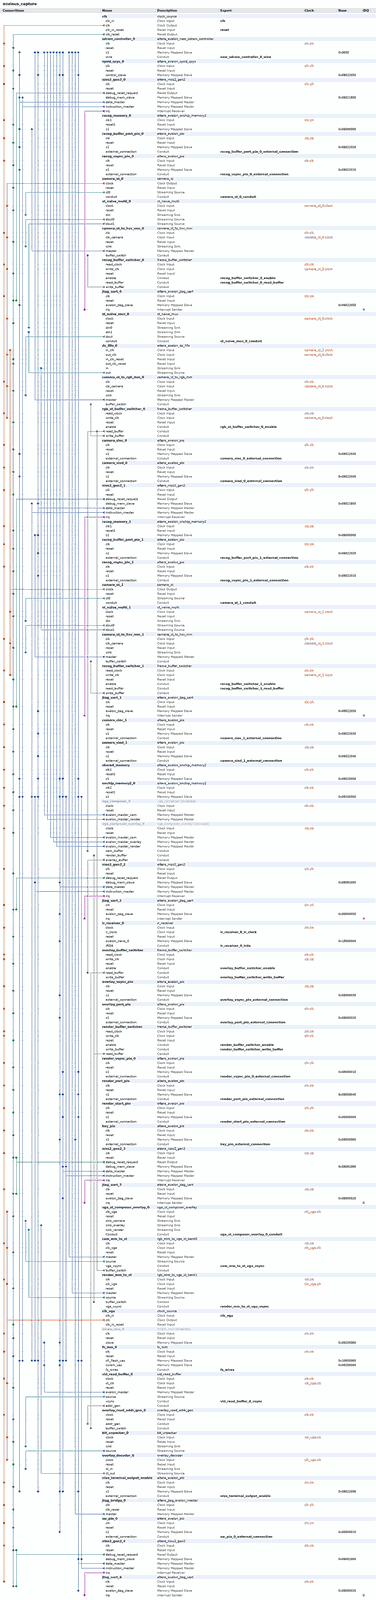
[diagram p0: system contents, whole]
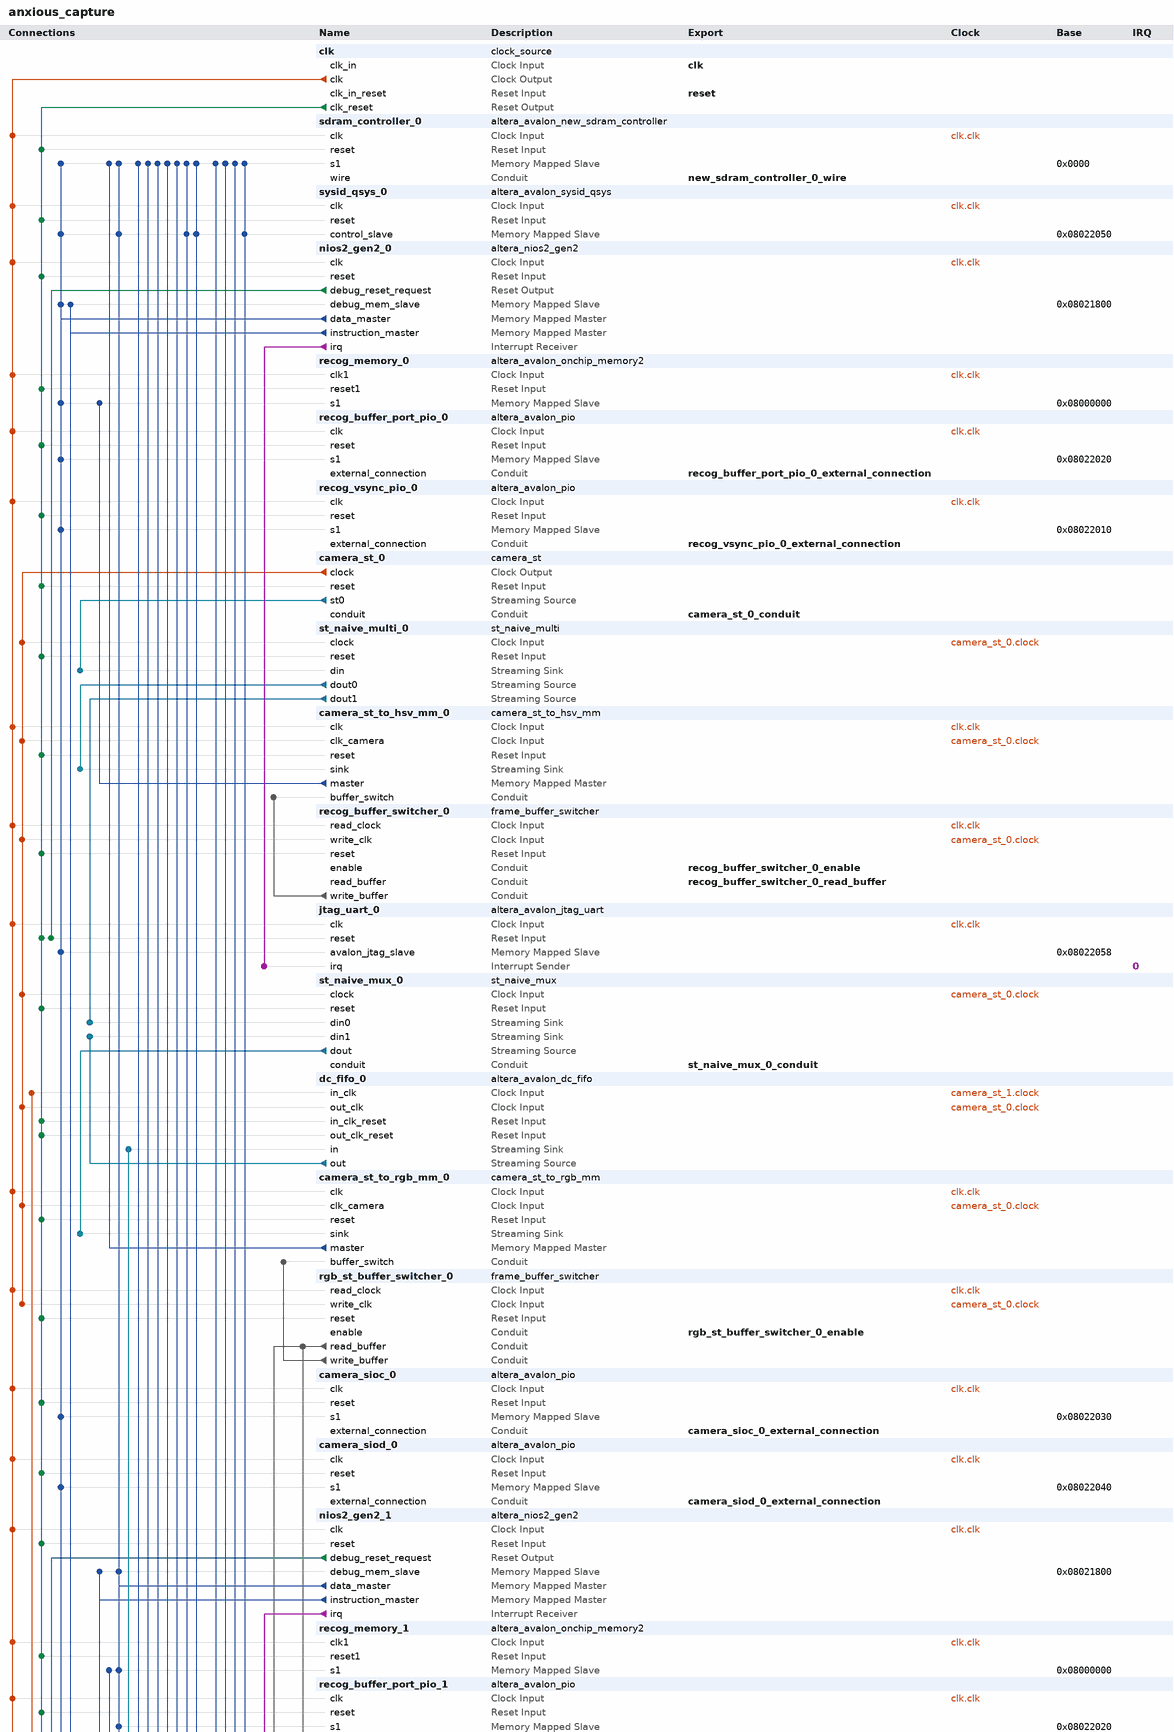
[diagram p1: system contents, upper part]
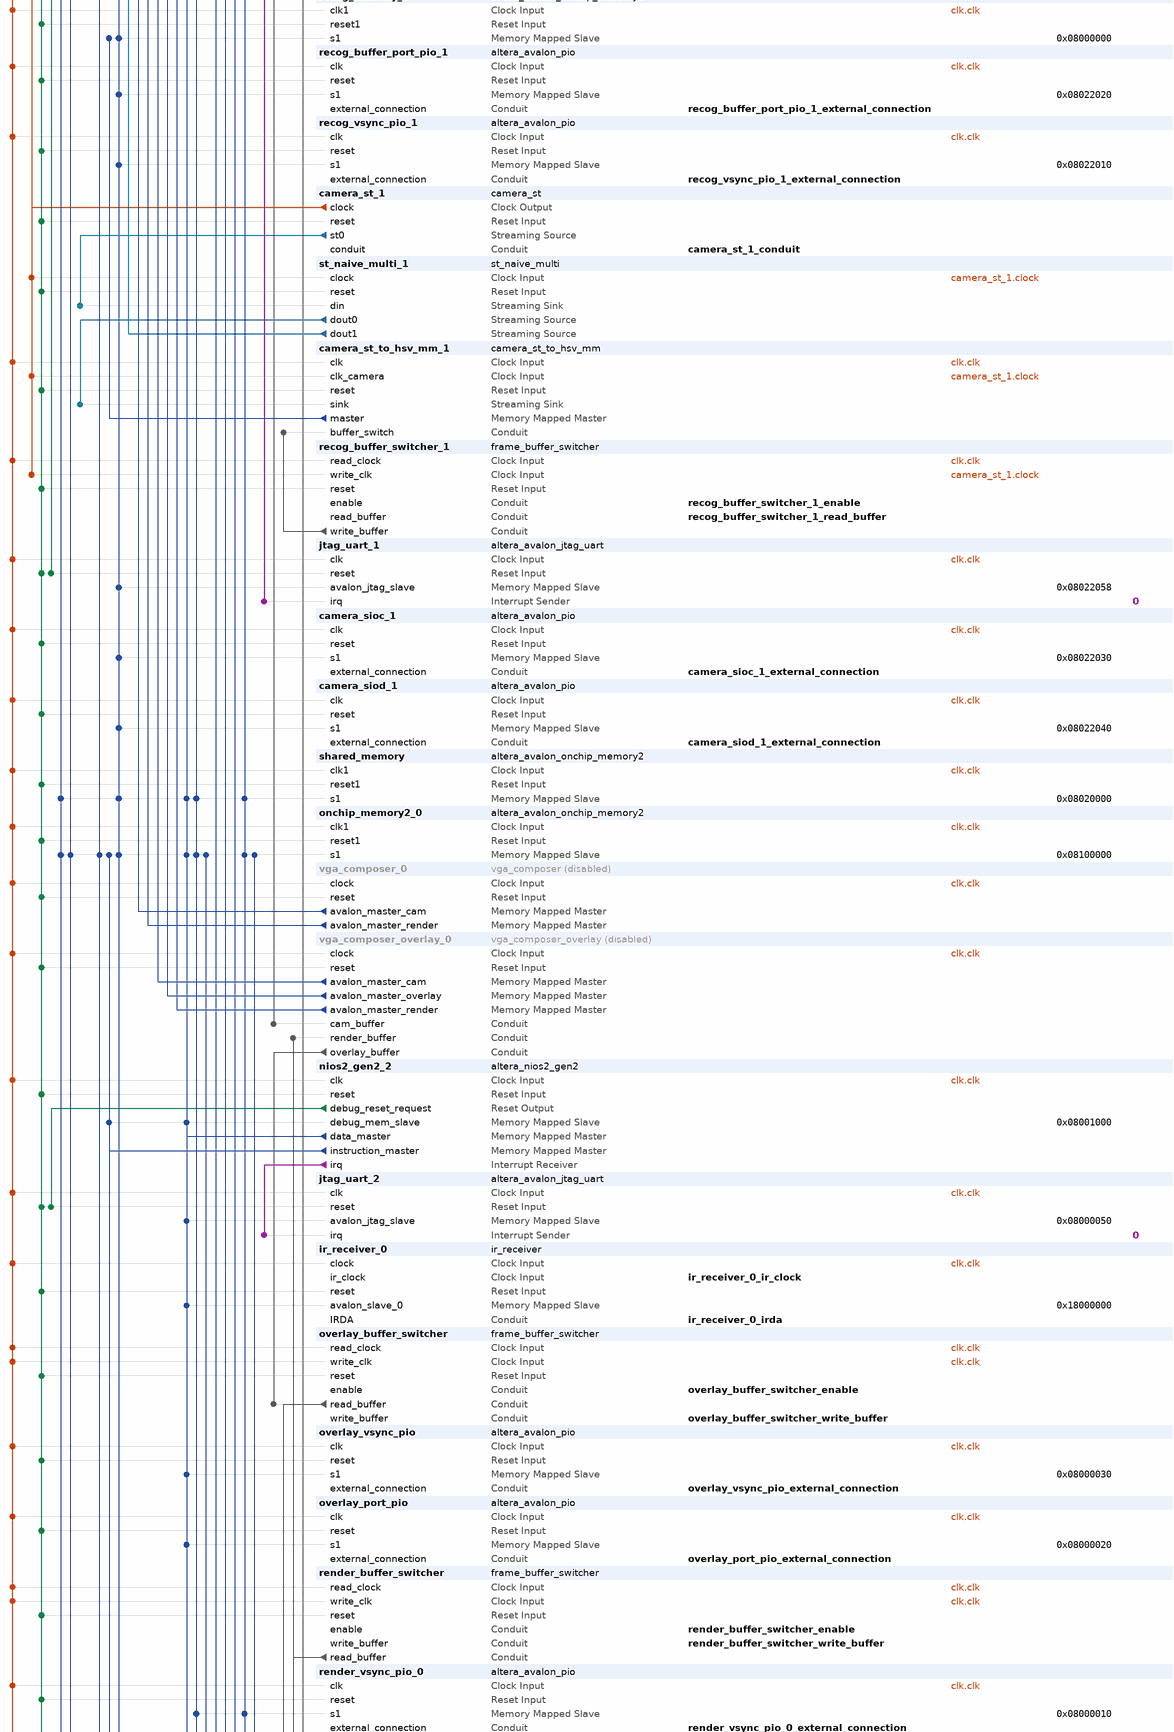
[diagram p2: system contents, middle part]
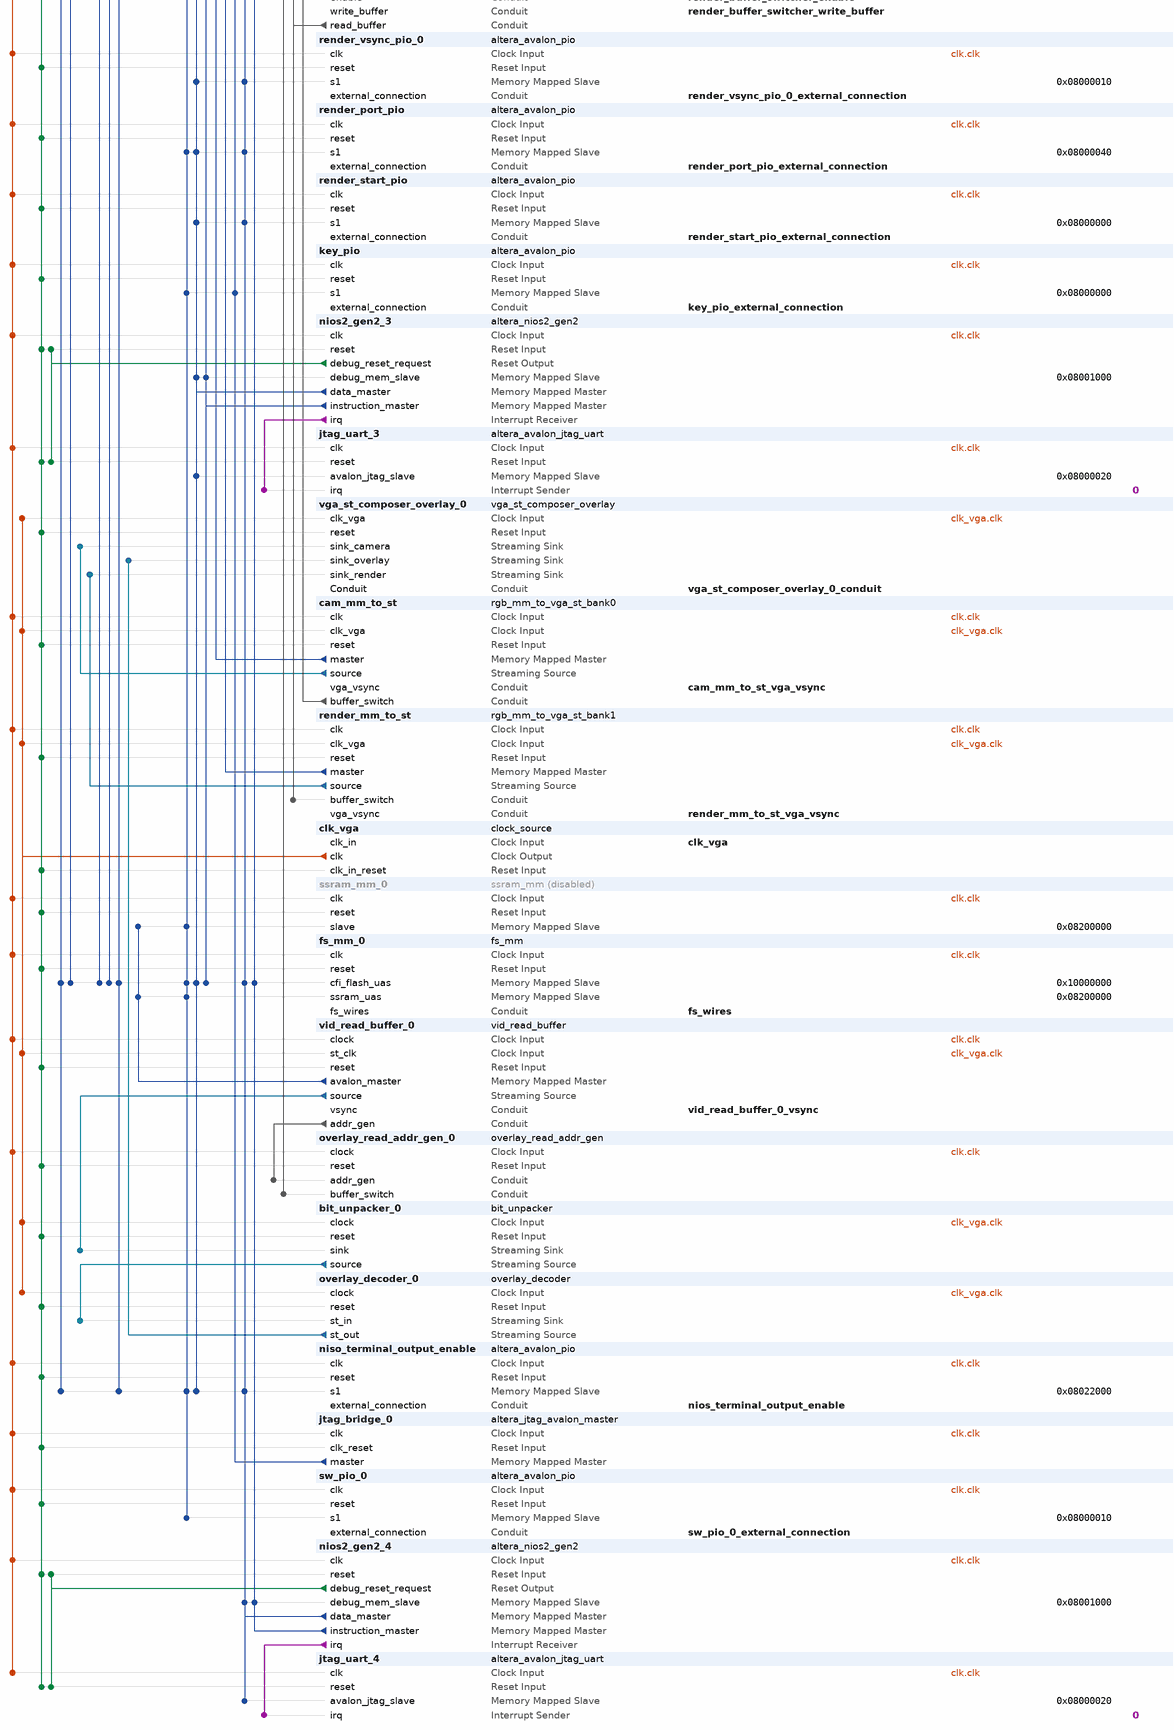
[diagram p3: system contents, lower part]
# Platform Designer (Qsys) system anxious_capture, Cyclone IV GX EP4CGX150DF31C7
# Parameters at their usual value, and those the tool derives, are not listed.
package require -exact qsys 15.0
create_system anxious_capture
set_project_property DEVICE_FAMILY {Cyclone IV GX}
set_project_property DEVICE EP4CGX150DF31C7

add_instance clk clock_source 15.0
set_instance_parameter_value clk clockFrequency 100000000

add_instance sdram_controller_0 altera_avalon_new_sdram_controller 15.0
set_instance_parameter_value sdram_controller_0 TAC 5.5
set_instance_parameter_value sdram_controller_0 TRCD 20.0
set_instance_parameter_value sdram_controller_0 TRP 20.0
set_instance_parameter_value sdram_controller_0 casLatency 3
set_instance_parameter_value sdram_controller_0 columnWidth 10
set_instance_parameter_value sdram_controller_0 dataWidth 32
set_instance_parameter_value sdram_controller_0 generateSimulationModel true
set_instance_parameter_value sdram_controller_0 initRefreshCommands 8
set_instance_parameter_value sdram_controller_0 model single_Micron_MT48LC4M32B2_7_chip
set_instance_parameter_value sdram_controller_0 numberOfBanks 4
set_instance_parameter_value sdram_controller_0 numberOfChipSelects 1
set_instance_parameter_value sdram_controller_0 powerUpDelay 100.0
set_instance_parameter_value sdram_controller_0 refreshPeriod 7.8125
set_instance_parameter_value sdram_controller_0 rowWidth 13

add_instance sysid_qsys_0 altera_avalon_sysid_qsys 15.0
set_instance_parameter_value sysid_qsys_0 id 286331153

add_instance nios2_gen2_0 altera_nios2_gen2 15.0
set_instance_parameter_value nios2_gen2_0 dcache_size 4096
set_instance_parameter_value nios2_gen2_0 dividerType srt2
set_instance_parameter_value nios2_gen2_0 exceptionSlave onchip_memory2_0.s1
set_instance_parameter_value nios2_gen2_0 icache_size 4096
set_instance_parameter_value nios2_gen2_0 impl Fast
set_instance_parameter_value nios2_gen2_0 resetSlave fs_mm_0_cfi_flash.uas

add_instance recog_memory_0 altera_avalon_onchip_memory2 15.0
set_instance_parameter_value recog_memory_0 dataWidth 32
set_instance_parameter_value recog_memory_0 dualPort false
set_instance_parameter_value recog_memory_0 initMemContent true
set_instance_parameter_value recog_memory_0 initializationFileName onchip_mem.hex
set_instance_parameter_value recog_memory_0 memorySize 81920

add_instance recog_buffer_port_pio_0 altera_avalon_pio 15.0
set_instance_parameter_value recog_buffer_port_pio_0 direction Input
set_instance_parameter_value recog_buffer_port_pio_0 width 2

add_instance recog_vsync_pio_0 altera_avalon_pio 15.0
set_instance_parameter_value recog_vsync_pio_0 direction Output
set_instance_parameter_value recog_vsync_pio_0 width 1

add_instance camera_st_0 camera_st 2.0
set_instance_parameter_value camera_st_0 DATA_WIDTH 24

add_instance st_naive_multi_0 st_naive_multi 1.0
set_instance_parameter_value st_naive_multi_0 DIN_DATA_WIDTH 24
set_instance_parameter_value st_naive_multi_0 DOUT0_DATA_WIDTH 24
set_instance_parameter_value st_naive_multi_0 DOUT1_DATA_WIDTH 32

add_instance camera_st_to_hsv_mm_0 camera_st_to_hsv_mm 1.0

add_instance recog_buffer_switcher_0 frame_buffer_switcher 2.0

add_instance jtag_uart_0 altera_avalon_jtag_uart 15.0
set_instance_parameter_value jtag_uart_0 simInteractiveOptions NO_INTERACTIVE_WINDOWS

add_instance st_naive_mux_0 st_naive_mux 1.0
set_instance_parameter_value st_naive_mux_0 DATA_WIDTH 32

add_instance dc_fifo_0 altera_avalon_dc_fifo 15.0
set_instance_parameter_value dc_fifo_0 BITS_PER_SYMBOL 8
set_instance_parameter_value dc_fifo_0 FIFO_DEPTH 16
set_instance_parameter_value dc_fifo_0 SYMBOLS_PER_BEAT 4
set_instance_parameter_value dc_fifo_0 USE_PACKETS 1

add_instance camera_st_to_rgb_mm_0 camera_st_to_rgb_mm 1.0

add_instance rgb_st_buffer_switcher_0 frame_buffer_switcher 2.0

add_instance camera_sioc_0 altera_avalon_pio 15.0
set_instance_parameter_value camera_sioc_0 direction Output
set_instance_parameter_value camera_sioc_0 width 1

add_instance camera_siod_0 altera_avalon_pio 15.0
set_instance_parameter_value camera_siod_0 direction Bidir
set_instance_parameter_value camera_siod_0 width 1

add_instance nios2_gen2_1 altera_nios2_gen2 15.0
set_instance_parameter_value nios2_gen2_1 cpuID 1
set_instance_parameter_value nios2_gen2_1 dcache_size 2048
set_instance_parameter_value nios2_gen2_1 dividerType srt2
set_instance_parameter_value nios2_gen2_1 exceptionOffset 81952
set_instance_parameter_value nios2_gen2_1 exceptionSlave onchip_memory2_0.s1
set_instance_parameter_value nios2_gen2_1 icache_size 4096
set_instance_parameter_value nios2_gen2_1 impl Fast
set_instance_parameter_value nios2_gen2_1 mul_64_impl 1
set_instance_parameter_value nios2_gen2_1 resetOffset 262144
set_instance_parameter_value nios2_gen2_1 resetSlave fs_mm_0_cfi_flash.uas

add_instance recog_memory_1 altera_avalon_onchip_memory2 15.0
set_instance_parameter_value recog_memory_1 dataWidth 32
set_instance_parameter_value recog_memory_1 dualPort false
set_instance_parameter_value recog_memory_1 initMemContent true
set_instance_parameter_value recog_memory_1 initializationFileName onchip_mem.hex
set_instance_parameter_value recog_memory_1 memorySize 81920

add_instance recog_buffer_port_pio_1 altera_avalon_pio 15.0
set_instance_parameter_value recog_buffer_port_pio_1 direction Input
set_instance_parameter_value recog_buffer_port_pio_1 width 2

add_instance recog_vsync_pio_1 altera_avalon_pio 15.0
set_instance_parameter_value recog_vsync_pio_1 direction Output
set_instance_parameter_value recog_vsync_pio_1 width 1

add_instance camera_st_1 camera_st 2.0
set_instance_parameter_value camera_st_1 DATA_WIDTH 24

add_instance st_naive_multi_1 st_naive_multi 1.0
set_instance_parameter_value st_naive_multi_1 DIN_DATA_WIDTH 24
set_instance_parameter_value st_naive_multi_1 DOUT0_DATA_WIDTH 24
set_instance_parameter_value st_naive_multi_1 DOUT1_DATA_WIDTH 32

add_instance camera_st_to_hsv_mm_1 camera_st_to_hsv_mm 1.0

add_instance recog_buffer_switcher_1 frame_buffer_switcher 2.0

add_instance jtag_uart_1 altera_avalon_jtag_uart 15.0
set_instance_parameter_value jtag_uart_1 simInteractiveOptions NO_INTERACTIVE_WINDOWS

add_instance camera_sioc_1 altera_avalon_pio 15.0
set_instance_parameter_value camera_sioc_1 direction Output
set_instance_parameter_value camera_sioc_1 width 1

add_instance camera_siod_1 altera_avalon_pio 15.0
set_instance_parameter_value camera_siod_1 direction Bidir
set_instance_parameter_value camera_siod_1 width 1

add_instance shared_memory altera_avalon_onchip_memory2 15.0
set_instance_parameter_value shared_memory dataWidth 32
set_instance_parameter_value shared_memory dualPort false
set_instance_parameter_value shared_memory initMemContent true
set_instance_parameter_value shared_memory initializationFileName onchip_mem.hex
set_instance_parameter_value shared_memory memorySize 4096
set_instance_parameter_value shared_memory singleClockOperation true

add_instance onchip_memory2_0 altera_avalon_onchip_memory2 15.0
set_instance_parameter_value onchip_memory2_0 dataWidth 32
set_instance_parameter_value onchip_memory2_0 dualPort false
set_instance_parameter_value onchip_memory2_0 initMemContent true
set_instance_parameter_value onchip_memory2_0 initializationFileName onchip_mem.hex
set_instance_parameter_value onchip_memory2_0 memorySize 409600

add_instance vga_composer_0 vga_composer 1.1
set_instance_property vga_composer_0 ENABLED false
set_instance_parameter_value vga_composer_0 ADDR_WIDTH 27
set_instance_parameter_value vga_composer_0 CAM_BANK 0
set_instance_parameter_value vga_composer_0 DATA_WIDTH 32
set_instance_parameter_value vga_composer_0 FIFO_LENGTH_LOG_2 6
set_instance_parameter_value vga_composer_0 RENDER_BANK 1

add_instance vga_composer_overlay_0 vga_composer_overlay 1.0
set_instance_property vga_composer_overlay_0 ENABLED false
set_instance_parameter_value vga_composer_overlay_0 ADDR_WIDTH 27
set_instance_parameter_value vga_composer_overlay_0 CAM_BANK 0
set_instance_parameter_value vga_composer_overlay_0 DATA_WIDTH 32
set_instance_parameter_value vga_composer_overlay_0 FIFO_LENGTH_LOG_2 7
set_instance_parameter_value vga_composer_overlay_0 OVERLAY_BANK 2
set_instance_parameter_value vga_composer_overlay_0 RENDER_BANK 1

add_instance nios2_gen2_2 altera_nios2_gen2 15.0
set_instance_parameter_value nios2_gen2_2 dcache_size 2048
set_instance_parameter_value nios2_gen2_2 exceptionOffset 163872
set_instance_parameter_value nios2_gen2_2 exceptionSlave onchip_memory2_0.s1
set_instance_parameter_value nios2_gen2_2 icache_size 4096
set_instance_parameter_value nios2_gen2_2 impl Fast
set_instance_parameter_value nios2_gen2_2 resetOffset 524288
set_instance_parameter_value nios2_gen2_2 resetSlave fs_mm_0_cfi_flash.uas

add_instance jtag_uart_2 altera_avalon_jtag_uart 15.0
set_instance_parameter_value jtag_uart_2 simInteractiveOptions NO_INTERACTIVE_WINDOWS

add_instance ir_receiver_0 ir_receiver 1.0

add_instance overlay_buffer_switcher frame_buffer_switcher 2.0

add_instance overlay_vsync_pio altera_avalon_pio 15.0
set_instance_parameter_value overlay_vsync_pio direction Output
set_instance_parameter_value overlay_vsync_pio width 1

add_instance overlay_port_pio altera_avalon_pio 15.0
set_instance_parameter_value overlay_port_pio direction Input
set_instance_parameter_value overlay_port_pio width 2

add_instance render_buffer_switcher frame_buffer_switcher 2.0

add_instance render_vsync_pio_0 altera_avalon_pio 15.0
set_instance_parameter_value render_vsync_pio_0 direction Output
set_instance_parameter_value render_vsync_pio_0 width 1

add_instance render_port_pio altera_avalon_pio 15.0
set_instance_parameter_value render_port_pio direction Input
set_instance_parameter_value render_port_pio width 2

add_instance render_start_pio altera_avalon_pio 15.0
set_instance_parameter_value render_start_pio direction Input
set_instance_parameter_value render_start_pio width 1

add_instance key_pio altera_avalon_pio 15.0
set_instance_parameter_value key_pio direction Input
set_instance_parameter_value key_pio width 1

add_instance nios2_gen2_3 altera_nios2_gen2 15.0
set_instance_parameter_value nios2_gen2_3 dcache_size 2048
set_instance_parameter_value nios2_gen2_3 exceptionOffset 245792
set_instance_parameter_value nios2_gen2_3 exceptionSlave onchip_memory2_0.s1
set_instance_parameter_value nios2_gen2_3 icache_size 4096
set_instance_parameter_value nios2_gen2_3 impl Fast
set_instance_parameter_value nios2_gen2_3 resetOffset 786432
set_instance_parameter_value nios2_gen2_3 resetSlave fs_mm_0_cfi_flash.uas

add_instance jtag_uart_3 altera_avalon_jtag_uart 15.0
set_instance_parameter_value jtag_uart_3 simInteractiveOptions NO_INTERACTIVE_WINDOWS

add_instance vga_st_composer_overlay_0 vga_st_composer_overlay 1.0
set_instance_parameter_value vga_st_composer_overlay_0 DATA_WIDTH 32
set_instance_parameter_value vga_st_composer_overlay_0 FIFO_LENGTH_LOG_2 6

add_instance cam_mm_to_st rgb_mm_to_vga_st_bank0 1.0

add_instance render_mm_to_st rgb_mm_to_vga_st_bank1 1.0

add_instance clk_vga clock_source 15.0
set_instance_parameter_value clk_vga clockFrequency 25000000

add_instance ssram_mm_0 ssram_mm 1.0
set_instance_property ssram_mm_0 ENABLED false

add_instance fs_mm_0 fs_mm 1.0

add_instance vid_read_buffer_0 vid_read_buffer 1.0
set_instance_parameter_value vid_read_buffer_0 ADDR_WIDTH 32
set_instance_parameter_value vid_read_buffer_0 DATA_WIDTH 8
set_instance_parameter_value vid_read_buffer_0 FIFO_LENGTH_LOG_2 6

add_instance overlay_read_addr_gen_0 overlay_read_addr_gen 1.0
set_instance_parameter_value overlay_read_addr_gen_0 ADDR_BASE 136314880
set_instance_parameter_value overlay_read_addr_gen_0 ADDR_WIDTH 32
set_instance_parameter_value overlay_read_addr_gen_0 HEIGHT 480
set_instance_parameter_value overlay_read_addr_gen_0 WIDTH 640

add_instance bit_unpacker_0 bit_unpacker 1.0
set_instance_parameter_value bit_unpacker_0 DIN_WIDTH 8
set_instance_parameter_value bit_unpacker_0 DOUT_WIDTH 4

add_instance overlay_decoder_0 overlay_decoder 1.0

add_instance niso_terminal_output_enable altera_avalon_pio 15.0
set_instance_parameter_value niso_terminal_output_enable direction Input
set_instance_parameter_value niso_terminal_output_enable width 1

add_instance jtag_bridge_0 altera_jtag_avalon_master 15.0

add_instance sw_pio_0 altera_avalon_pio 15.0
set_instance_parameter_value sw_pio_0 direction Input
set_instance_parameter_value sw_pio_0 simDoTestBenchWiring true
set_instance_parameter_value sw_pio_0 width 18

add_instance nios2_gen2_4 altera_nios2_gen2 15.0
set_instance_parameter_value nios2_gen2_4 dcache_size 2048
set_instance_parameter_value nios2_gen2_4 exceptionOffset 327712
set_instance_parameter_value nios2_gen2_4 exceptionSlave onchip_memory2_0.s1
set_instance_parameter_value nios2_gen2_4 icache_size 4096
set_instance_parameter_value nios2_gen2_4 impl Fast
set_instance_parameter_value nios2_gen2_4 resetOffset 1048576
set_instance_parameter_value nios2_gen2_4 resetSlave fs_mm_0_cfi_flash.uas

add_instance jtag_uart_4 altera_avalon_jtag_uart 15.0
set_instance_parameter_value jtag_uart_4 simInteractiveOptions NO_INTERACTIVE_WINDOWS

# connections
add_connection camera_st_0.clock camera_st_to_hsv_mm_0.clk_camera clock
add_connection camera_st_0.clock camera_st_to_rgb_mm_0.clk_camera clock
add_connection camera_st_0.clock dc_fifo_0.out_clk clock
add_connection camera_st_0.clock recog_buffer_switcher_0.write_clk clock
add_connection camera_st_0.clock rgb_st_buffer_switcher_0.write_clk clock
add_connection camera_st_0.clock st_naive_multi_0.clock clock
add_connection camera_st_0.clock st_naive_mux_0.clock clock
add_connection camera_st_1.clock camera_st_to_hsv_mm_1.clk_camera clock
add_connection camera_st_1.clock dc_fifo_0.in_clk clock
add_connection camera_st_1.clock recog_buffer_switcher_1.write_clk clock
add_connection camera_st_1.clock st_naive_multi_1.clock clock
add_connection clk.clk cam_mm_to_st.clk clock
add_connection clk.clk camera_sioc_0.clk clock
add_connection clk.clk camera_sioc_1.clk clock
add_connection clk.clk camera_siod_0.clk clock
add_connection clk.clk camera_siod_1.clk clock
add_connection clk.clk camera_st_to_hsv_mm_0.clk clock
add_connection clk.clk camera_st_to_hsv_mm_1.clk clock
add_connection clk.clk camera_st_to_rgb_mm_0.clk clock
add_connection clk.clk fs_mm_0.clk clock
add_connection clk.clk ir_receiver_0.clock clock
add_connection clk.clk jtag_bridge_0.clk clock
add_connection clk.clk jtag_uart_0.clk clock
add_connection clk.clk jtag_uart_1.clk clock
add_connection clk.clk jtag_uart_2.clk clock
add_connection clk.clk jtag_uart_3.clk clock
add_connection clk.clk jtag_uart_4.clk clock
add_connection clk.clk key_pio.clk clock
add_connection clk.clk nios2_gen2_0.clk clock
add_connection clk.clk nios2_gen2_1.clk clock
add_connection clk.clk nios2_gen2_2.clk clock
add_connection clk.clk nios2_gen2_3.clk clock
add_connection clk.clk nios2_gen2_4.clk clock
add_connection clk.clk niso_terminal_output_enable.clk clock
add_connection clk.clk onchip_memory2_0.clk1 clock
add_connection clk.clk overlay_buffer_switcher.read_clock clock
add_connection clk.clk overlay_buffer_switcher.write_clk clock
add_connection clk.clk overlay_port_pio.clk clock
add_connection clk.clk overlay_read_addr_gen_0.clock clock
add_connection clk.clk overlay_vsync_pio.clk clock
add_connection clk.clk recog_buffer_port_pio_0.clk clock
add_connection clk.clk recog_buffer_port_pio_1.clk clock
add_connection clk.clk recog_buffer_switcher_0.read_clock clock
add_connection clk.clk recog_buffer_switcher_1.read_clock clock
add_connection clk.clk recog_memory_0.clk1 clock
add_connection clk.clk recog_memory_1.clk1 clock
add_connection clk.clk recog_vsync_pio_0.clk clock
add_connection clk.clk recog_vsync_pio_1.clk clock
add_connection clk.clk render_buffer_switcher.read_clock clock
add_connection clk.clk render_buffer_switcher.write_clk clock
add_connection clk.clk render_mm_to_st.clk clock
add_connection clk.clk render_port_pio.clk clock
add_connection clk.clk render_start_pio.clk clock
add_connection clk.clk render_vsync_pio_0.clk clock
add_connection clk.clk rgb_st_buffer_switcher_0.read_clock clock
add_connection clk.clk sdram_controller_0.clk clock
add_connection clk.clk shared_memory.clk1 clock
add_connection clk.clk ssram_mm_0.clk clock
add_connection clk.clk sw_pio_0.clk clock
add_connection clk.clk sysid_qsys_0.clk clock
add_connection clk.clk vga_composer_0.clock clock
add_connection clk.clk vga_composer_overlay_0.clock clock
add_connection clk.clk vid_read_buffer_0.clock clock
add_connection clk_vga.clk bit_unpacker_0.clock clock
add_connection clk_vga.clk cam_mm_to_st.clk_vga clock
add_connection clk_vga.clk overlay_decoder_0.clock clock
add_connection clk_vga.clk render_mm_to_st.clk_vga clock
add_connection clk_vga.clk vga_st_composer_overlay_0.clk_vga clock
add_connection clk_vga.clk vid_read_buffer_0.st_clk clock
add_connection clk.clk_reset bit_unpacker_0.reset reset
add_connection clk.clk_reset cam_mm_to_st.reset reset
add_connection clk.clk_reset camera_sioc_0.reset reset
add_connection clk.clk_reset camera_sioc_1.reset reset
add_connection clk.clk_reset camera_siod_0.reset reset
add_connection clk.clk_reset camera_siod_1.reset reset
add_connection clk.clk_reset camera_st_0.reset reset
add_connection clk.clk_reset camera_st_1.reset reset
add_connection clk.clk_reset camera_st_to_hsv_mm_0.reset reset
add_connection clk.clk_reset camera_st_to_hsv_mm_1.reset reset
add_connection clk.clk_reset camera_st_to_rgb_mm_0.reset reset
add_connection clk.clk_reset clk_vga.clk_in_reset reset
add_connection clk.clk_reset dc_fifo_0.in_clk_reset reset
add_connection clk.clk_reset dc_fifo_0.out_clk_reset reset
add_connection clk.clk_reset fs_mm_0.reset reset
add_connection clk.clk_reset ir_receiver_0.reset reset
add_connection clk.clk_reset jtag_bridge_0.clk_reset reset
add_connection clk.clk_reset jtag_uart_0.reset reset
add_connection clk.clk_reset jtag_uart_1.reset reset
add_connection clk.clk_reset jtag_uart_2.reset reset
add_connection clk.clk_reset jtag_uart_3.reset reset
add_connection clk.clk_reset jtag_uart_4.reset reset
add_connection clk.clk_reset key_pio.reset reset
add_connection clk.clk_reset nios2_gen2_0.reset reset
add_connection clk.clk_reset nios2_gen2_1.reset reset
add_connection clk.clk_reset nios2_gen2_2.reset reset
add_connection clk.clk_reset nios2_gen2_3.reset reset
add_connection clk.clk_reset nios2_gen2_4.reset reset
add_connection clk.clk_reset niso_terminal_output_enable.reset reset
add_connection clk.clk_reset onchip_memory2_0.reset1 reset
add_connection clk.clk_reset overlay_buffer_switcher.reset reset
add_connection clk.clk_reset overlay_decoder_0.reset reset
add_connection clk.clk_reset overlay_port_pio.reset reset
add_connection clk.clk_reset overlay_read_addr_gen_0.reset reset
add_connection clk.clk_reset overlay_vsync_pio.reset reset
add_connection clk.clk_reset recog_buffer_port_pio_0.reset reset
add_connection clk.clk_reset recog_buffer_port_pio_1.reset reset
add_connection clk.clk_reset recog_buffer_switcher_0.reset reset
add_connection clk.clk_reset recog_buffer_switcher_1.reset reset
add_connection clk.clk_reset recog_memory_0.reset1 reset
add_connection clk.clk_reset recog_memory_1.reset1 reset
add_connection clk.clk_reset recog_vsync_pio_0.reset reset
add_connection clk.clk_reset recog_vsync_pio_1.reset reset
add_connection clk.clk_reset render_buffer_switcher.reset reset
add_connection clk.clk_reset render_mm_to_st.reset reset
add_connection clk.clk_reset render_port_pio.reset reset
add_connection clk.clk_reset render_start_pio.reset reset
add_connection clk.clk_reset render_vsync_pio_0.reset reset
add_connection clk.clk_reset rgb_st_buffer_switcher_0.reset reset
add_connection clk.clk_reset sdram_controller_0.reset reset
add_connection clk.clk_reset shared_memory.reset1 reset
add_connection clk.clk_reset ssram_mm_0.reset reset
add_connection clk.clk_reset st_naive_multi_0.reset reset
add_connection clk.clk_reset st_naive_multi_1.reset reset
add_connection clk.clk_reset st_naive_mux_0.reset reset
add_connection clk.clk_reset sw_pio_0.reset reset
add_connection clk.clk_reset sysid_qsys_0.reset reset
add_connection clk.clk_reset vga_composer_0.reset reset
add_connection clk.clk_reset vga_composer_overlay_0.reset reset
add_connection clk.clk_reset vga_st_composer_overlay_0.reset reset
add_connection clk.clk_reset vid_read_buffer_0.reset reset
add_connection nios2_gen2_0.debug_reset_request jtag_uart_0.reset reset
add_connection nios2_gen2_1.debug_reset_request jtag_uart_1.reset reset
add_connection nios2_gen2_2.debug_reset_request jtag_uart_2.reset reset
add_connection nios2_gen2_3.debug_reset_request jtag_uart_3.reset reset
add_connection nios2_gen2_3.debug_reset_request nios2_gen2_3.reset reset
add_connection nios2_gen2_4.debug_reset_request jtag_uart_4.reset reset
add_connection nios2_gen2_4.debug_reset_request nios2_gen2_4.reset reset
add_connection cam_mm_to_st.master sdram_controller_0.s1 avalon
set_connection_parameter_value cam_mm_to_st.master/sdram_controller_0.s1 baseAddress 0x0000
add_connection camera_st_to_hsv_mm_0.master recog_memory_0.s1 avalon
set_connection_parameter_value camera_st_to_hsv_mm_0.master/recog_memory_0.s1 baseAddress 0x08000000
add_connection camera_st_to_hsv_mm_1.master recog_memory_1.s1 avalon
set_connection_parameter_value camera_st_to_hsv_mm_1.master/recog_memory_1.s1 baseAddress 0x08000000
add_connection camera_st_to_rgb_mm_0.master sdram_controller_0.s1 avalon
set_connection_parameter_value camera_st_to_rgb_mm_0.master/sdram_controller_0.s1 baseAddress 0x0000
add_connection jtag_bridge_0.master key_pio.s1 avalon
set_connection_parameter_value jtag_bridge_0.master/key_pio.s1 baseAddress 0x08000000
add_connection jtag_bridge_0.master sdram_controller_0.s1 avalon
set_connection_parameter_value jtag_bridge_0.master/sdram_controller_0.s1 baseAddress 0x0000
add_connection nios2_gen2_0.data_master camera_sioc_0.s1 avalon
set_connection_parameter_value nios2_gen2_0.data_master/camera_sioc_0.s1 baseAddress 0x08022030
add_connection nios2_gen2_0.data_master camera_siod_0.s1 avalon
set_connection_parameter_value nios2_gen2_0.data_master/camera_siod_0.s1 baseAddress 0x08022040
add_connection nios2_gen2_0.data_master fs_mm_0.cfi_flash_uas avalon
set_connection_parameter_value nios2_gen2_0.data_master/fs_mm_0.cfi_flash_uas baseAddress 0x10000000
add_connection nios2_gen2_0.data_master jtag_uart_0.avalon_jtag_slave avalon
set_connection_parameter_value nios2_gen2_0.data_master/jtag_uart_0.avalon_jtag_slave baseAddress 0x08022058
add_connection nios2_gen2_0.data_master nios2_gen2_0.debug_mem_slave avalon
set_connection_parameter_value nios2_gen2_0.data_master/nios2_gen2_0.debug_mem_slave baseAddress 0x08021800
add_connection nios2_gen2_0.data_master niso_terminal_output_enable.s1 avalon
set_connection_parameter_value nios2_gen2_0.data_master/niso_terminal_output_enable.s1 baseAddress 0x08022000
add_connection nios2_gen2_0.data_master onchip_memory2_0.s1 avalon
set_connection_parameter_value nios2_gen2_0.data_master/onchip_memory2_0.s1 baseAddress 0x08100000
add_connection nios2_gen2_0.data_master recog_buffer_port_pio_0.s1 avalon
set_connection_parameter_value nios2_gen2_0.data_master/recog_buffer_port_pio_0.s1 baseAddress 0x08022020
add_connection nios2_gen2_0.data_master recog_memory_0.s1 avalon
set_connection_parameter_value nios2_gen2_0.data_master/recog_memory_0.s1 baseAddress 0x08000000
add_connection nios2_gen2_0.data_master recog_vsync_pio_0.s1 avalon
set_connection_parameter_value nios2_gen2_0.data_master/recog_vsync_pio_0.s1 baseAddress 0x08022010
add_connection nios2_gen2_0.data_master sdram_controller_0.s1 avalon
set_connection_parameter_value nios2_gen2_0.data_master/sdram_controller_0.s1 baseAddress 0x0000
add_connection nios2_gen2_0.data_master shared_memory.s1 avalon
set_connection_parameter_value nios2_gen2_0.data_master/shared_memory.s1 baseAddress 0x08020000
add_connection nios2_gen2_0.data_master sysid_qsys_0.control_slave avalon
set_connection_parameter_value nios2_gen2_0.data_master/sysid_qsys_0.control_slave baseAddress 0x08022050
add_connection nios2_gen2_0.instruction_master fs_mm_0.cfi_flash_uas avalon
set_connection_parameter_value nios2_gen2_0.instruction_master/fs_mm_0.cfi_flash_uas baseAddress 0x10000000
add_connection nios2_gen2_0.instruction_master nios2_gen2_0.debug_mem_slave avalon
set_connection_parameter_value nios2_gen2_0.instruction_master/nios2_gen2_0.debug_mem_slave baseAddress 0x08021800
add_connection nios2_gen2_0.instruction_master onchip_memory2_0.s1 avalon
set_connection_parameter_value nios2_gen2_0.instruction_master/onchip_memory2_0.s1 baseAddress 0x08100000
add_connection nios2_gen2_1.data_master camera_sioc_1.s1 avalon
set_connection_parameter_value nios2_gen2_1.data_master/camera_sioc_1.s1 baseAddress 0x08022030
add_connection nios2_gen2_1.data_master camera_siod_1.s1 avalon
set_connection_parameter_value nios2_gen2_1.data_master/camera_siod_1.s1 baseAddress 0x08022040
add_connection nios2_gen2_1.data_master fs_mm_0.cfi_flash_uas avalon
set_connection_parameter_value nios2_gen2_1.data_master/fs_mm_0.cfi_flash_uas baseAddress 0x10000000
add_connection nios2_gen2_1.data_master jtag_uart_1.avalon_jtag_slave avalon
set_connection_parameter_value nios2_gen2_1.data_master/jtag_uart_1.avalon_jtag_slave baseAddress 0x08022058
add_connection nios2_gen2_1.data_master nios2_gen2_1.debug_mem_slave avalon
set_connection_parameter_value nios2_gen2_1.data_master/nios2_gen2_1.debug_mem_slave baseAddress 0x08021800
add_connection nios2_gen2_1.data_master niso_terminal_output_enable.s1 avalon
set_connection_parameter_value nios2_gen2_1.data_master/niso_terminal_output_enable.s1 baseAddress 0x08022000
add_connection nios2_gen2_1.data_master onchip_memory2_0.s1 avalon
set_connection_parameter_value nios2_gen2_1.data_master/onchip_memory2_0.s1 baseAddress 0x08100000
add_connection nios2_gen2_1.data_master recog_buffer_port_pio_1.s1 avalon
set_connection_parameter_value nios2_gen2_1.data_master/recog_buffer_port_pio_1.s1 baseAddress 0x08022020
add_connection nios2_gen2_1.data_master recog_memory_1.s1 avalon
set_connection_parameter_value nios2_gen2_1.data_master/recog_memory_1.s1 baseAddress 0x08000000
add_connection nios2_gen2_1.data_master recog_vsync_pio_1.s1 avalon
set_connection_parameter_value nios2_gen2_1.data_master/recog_vsync_pio_1.s1 baseAddress 0x08022010
add_connection nios2_gen2_1.data_master sdram_controller_0.s1 avalon
set_connection_parameter_value nios2_gen2_1.data_master/sdram_controller_0.s1 baseAddress 0x0000
add_connection nios2_gen2_1.data_master shared_memory.s1 avalon
set_connection_parameter_value nios2_gen2_1.data_master/shared_memory.s1 baseAddress 0x08020000
add_connection nios2_gen2_1.data_master sysid_qsys_0.control_slave avalon
set_connection_parameter_value nios2_gen2_1.data_master/sysid_qsys_0.control_slave baseAddress 0x08022050
add_connection nios2_gen2_1.instruction_master fs_mm_0.cfi_flash_uas avalon
set_connection_parameter_value nios2_gen2_1.instruction_master/fs_mm_0.cfi_flash_uas baseAddress 0x10000000
add_connection nios2_gen2_1.instruction_master nios2_gen2_1.debug_mem_slave avalon
set_connection_parameter_value nios2_gen2_1.instruction_master/nios2_gen2_1.debug_mem_slave baseAddress 0x08021800
add_connection nios2_gen2_1.instruction_master onchip_memory2_0.s1 avalon
set_connection_parameter_value nios2_gen2_1.instruction_master/onchip_memory2_0.s1 baseAddress 0x08100000
add_connection nios2_gen2_2.data_master fs_mm_0.cfi_flash_uas avalon
set_connection_parameter_value nios2_gen2_2.data_master/fs_mm_0.cfi_flash_uas baseAddress 0x10000000
add_connection nios2_gen2_2.data_master fs_mm_0.ssram_uas avalon
set_connection_parameter_value nios2_gen2_2.data_master/fs_mm_0.ssram_uas baseAddress 0x08200000
add_connection nios2_gen2_2.data_master ir_receiver_0.avalon_slave_0 avalon
set_connection_parameter_value nios2_gen2_2.data_master/ir_receiver_0.avalon_slave_0 baseAddress 0x18000000
add_connection nios2_gen2_2.data_master jtag_uart_2.avalon_jtag_slave avalon
set_connection_parameter_value nios2_gen2_2.data_master/jtag_uart_2.avalon_jtag_slave baseAddress 0x08000050
add_connection nios2_gen2_2.data_master key_pio.s1 avalon
set_connection_parameter_value nios2_gen2_2.data_master/key_pio.s1 baseAddress 0x08000000
add_connection nios2_gen2_2.data_master nios2_gen2_2.debug_mem_slave avalon
set_connection_parameter_value nios2_gen2_2.data_master/nios2_gen2_2.debug_mem_slave baseAddress 0x08001000
add_connection nios2_gen2_2.data_master niso_terminal_output_enable.s1 avalon
set_connection_parameter_value nios2_gen2_2.data_master/niso_terminal_output_enable.s1 baseAddress 0x08022000
add_connection nios2_gen2_2.data_master onchip_memory2_0.s1 avalon
set_connection_parameter_value nios2_gen2_2.data_master/onchip_memory2_0.s1 baseAddress 0x08100000
add_connection nios2_gen2_2.data_master overlay_port_pio.s1 avalon
set_connection_parameter_value nios2_gen2_2.data_master/overlay_port_pio.s1 baseAddress 0x08000020
add_connection nios2_gen2_2.data_master overlay_vsync_pio.s1 avalon
set_connection_parameter_value nios2_gen2_2.data_master/overlay_vsync_pio.s1 baseAddress 0x08000030
add_connection nios2_gen2_2.data_master render_port_pio.s1 avalon
set_connection_parameter_value nios2_gen2_2.data_master/render_port_pio.s1 baseAddress 0x08000040
add_connection nios2_gen2_2.data_master sdram_controller_0.s1 avalon
set_connection_parameter_value nios2_gen2_2.data_master/sdram_controller_0.s1 baseAddress 0x0000
add_connection nios2_gen2_2.data_master shared_memory.s1 avalon
set_connection_parameter_value nios2_gen2_2.data_master/shared_memory.s1 baseAddress 0x08020000
add_connection nios2_gen2_2.data_master ssram_mm_0.slave avalon
set_connection_parameter_value nios2_gen2_2.data_master/ssram_mm_0.slave baseAddress 0x08200000
add_connection nios2_gen2_2.data_master sw_pio_0.s1 avalon
set_connection_parameter_value nios2_gen2_2.data_master/sw_pio_0.s1 baseAddress 0x08000010
add_connection nios2_gen2_2.data_master sysid_qsys_0.control_slave avalon
set_connection_parameter_value nios2_gen2_2.data_master/sysid_qsys_0.control_slave baseAddress 0x08022050
add_connection nios2_gen2_2.instruction_master fs_mm_0.cfi_flash_uas avalon
set_connection_parameter_value nios2_gen2_2.instruction_master/fs_mm_0.cfi_flash_uas baseAddress 0x10000000
add_connection nios2_gen2_2.instruction_master nios2_gen2_2.debug_mem_slave avalon
set_connection_parameter_value nios2_gen2_2.instruction_master/nios2_gen2_2.debug_mem_slave baseAddress 0x08001000
add_connection nios2_gen2_2.instruction_master onchip_memory2_0.s1 avalon
set_connection_parameter_value nios2_gen2_2.instruction_master/onchip_memory2_0.s1 baseAddress 0x08100000
add_connection nios2_gen2_3.data_master fs_mm_0.cfi_flash_uas avalon
set_connection_parameter_value nios2_gen2_3.data_master/fs_mm_0.cfi_flash_uas baseAddress 0x10000000
add_connection nios2_gen2_3.data_master jtag_uart_3.avalon_jtag_slave avalon
set_connection_parameter_value nios2_gen2_3.data_master/jtag_uart_3.avalon_jtag_slave baseAddress 0x08000020
add_connection nios2_gen2_3.data_master nios2_gen2_3.debug_mem_slave avalon
set_connection_parameter_value nios2_gen2_3.data_master/nios2_gen2_3.debug_mem_slave baseAddress 0x08001000
add_connection nios2_gen2_3.data_master niso_terminal_output_enable.s1 avalon
set_connection_parameter_value nios2_gen2_3.data_master/niso_terminal_output_enable.s1 baseAddress 0x08022000
add_connection nios2_gen2_3.data_master onchip_memory2_0.s1 avalon
set_connection_parameter_value nios2_gen2_3.data_master/onchip_memory2_0.s1 baseAddress 0x08100000
add_connection nios2_gen2_3.data_master render_port_pio.s1 avalon
set_connection_parameter_value nios2_gen2_3.data_master/render_port_pio.s1 baseAddress 0x08000040
add_connection nios2_gen2_3.data_master render_start_pio.s1 avalon
set_connection_parameter_value nios2_gen2_3.data_master/render_start_pio.s1 baseAddress 0x08000000
add_connection nios2_gen2_3.data_master render_vsync_pio_0.s1 avalon
set_connection_parameter_value nios2_gen2_3.data_master/render_vsync_pio_0.s1 baseAddress 0x08000010
add_connection nios2_gen2_3.data_master sdram_controller_0.s1 avalon
set_connection_parameter_value nios2_gen2_3.data_master/sdram_controller_0.s1 baseAddress 0x0000
add_connection nios2_gen2_3.data_master shared_memory.s1 avalon
set_connection_parameter_value nios2_gen2_3.data_master/shared_memory.s1 baseAddress 0x08020000
add_connection nios2_gen2_3.data_master sysid_qsys_0.control_slave avalon
set_connection_parameter_value nios2_gen2_3.data_master/sysid_qsys_0.control_slave baseAddress 0x08022050
add_connection nios2_gen2_3.instruction_master fs_mm_0.cfi_flash_uas avalon
set_connection_parameter_value nios2_gen2_3.instruction_master/fs_mm_0.cfi_flash_uas baseAddress 0x10000000
add_connection nios2_gen2_3.instruction_master nios2_gen2_3.debug_mem_slave avalon
set_connection_parameter_value nios2_gen2_3.instruction_master/nios2_gen2_3.debug_mem_slave baseAddress 0x08001000
add_connection nios2_gen2_3.instruction_master onchip_memory2_0.s1 avalon
set_connection_parameter_value nios2_gen2_3.instruction_master/onchip_memory2_0.s1 baseAddress 0x08100000
add_connection nios2_gen2_4.data_master fs_mm_0.cfi_flash_uas avalon
set_connection_parameter_value nios2_gen2_4.data_master/fs_mm_0.cfi_flash_uas baseAddress 0x10000000
add_connection nios2_gen2_4.data_master jtag_uart_4.avalon_jtag_slave avalon
set_connection_parameter_value nios2_gen2_4.data_master/jtag_uart_4.avalon_jtag_slave baseAddress 0x08000020
add_connection nios2_gen2_4.data_master nios2_gen2_4.debug_mem_slave avalon
set_connection_parameter_value nios2_gen2_4.data_master/nios2_gen2_4.debug_mem_slave baseAddress 0x08001000
add_connection nios2_gen2_4.data_master niso_terminal_output_enable.s1 avalon
set_connection_parameter_value nios2_gen2_4.data_master/niso_terminal_output_enable.s1 baseAddress 0x08022000
add_connection nios2_gen2_4.data_master onchip_memory2_0.s1 avalon
set_connection_parameter_value nios2_gen2_4.data_master/onchip_memory2_0.s1 baseAddress 0x08100000
add_connection nios2_gen2_4.data_master render_port_pio.s1 avalon
set_connection_parameter_value nios2_gen2_4.data_master/render_port_pio.s1 baseAddress 0x08000040
add_connection nios2_gen2_4.data_master render_start_pio.s1 avalon
set_connection_parameter_value nios2_gen2_4.data_master/render_start_pio.s1 baseAddress 0x08000000
add_connection nios2_gen2_4.data_master render_vsync_pio_0.s1 avalon
set_connection_parameter_value nios2_gen2_4.data_master/render_vsync_pio_0.s1 baseAddress 0x08000010
add_connection nios2_gen2_4.data_master sdram_controller_0.s1 avalon
set_connection_parameter_value nios2_gen2_4.data_master/sdram_controller_0.s1 baseAddress 0x0000
add_connection nios2_gen2_4.data_master shared_memory.s1 avalon
set_connection_parameter_value nios2_gen2_4.data_master/shared_memory.s1 baseAddress 0x08020000
add_connection nios2_gen2_4.data_master sysid_qsys_0.control_slave avalon
set_connection_parameter_value nios2_gen2_4.data_master/sysid_qsys_0.control_slave baseAddress 0x08022050
add_connection nios2_gen2_4.instruction_master fs_mm_0.cfi_flash_uas avalon
set_connection_parameter_value nios2_gen2_4.instruction_master/fs_mm_0.cfi_flash_uas baseAddress 0x10000000
add_connection nios2_gen2_4.instruction_master nios2_gen2_4.debug_mem_slave avalon
set_connection_parameter_value nios2_gen2_4.instruction_master/nios2_gen2_4.debug_mem_slave baseAddress 0x08001000
add_connection nios2_gen2_4.instruction_master onchip_memory2_0.s1 avalon
set_connection_parameter_value nios2_gen2_4.instruction_master/onchip_memory2_0.s1 baseAddress 0x08100000
add_connection render_mm_to_st.master sdram_controller_0.s1 avalon
set_connection_parameter_value render_mm_to_st.master/sdram_controller_0.s1 baseAddress 0x0000
add_connection vga_composer_0.avalon_master_cam sdram_controller_0.s1 avalon
set_connection_parameter_value vga_composer_0.avalon_master_cam/sdram_controller_0.s1 baseAddress 0x0000
add_connection vga_composer_0.avalon_master_render sdram_controller_0.s1 avalon
set_connection_parameter_value vga_composer_0.avalon_master_render/sdram_controller_0.s1 baseAddress 0x0000
add_connection vga_composer_overlay_0.avalon_master_cam sdram_controller_0.s1 avalon
set_connection_parameter_value vga_composer_overlay_0.avalon_master_cam/sdram_controller_0.s1 baseAddress 0x0000
add_connection vga_composer_overlay_0.avalon_master_overlay sdram_controller_0.s1 avalon
set_connection_parameter_value vga_composer_overlay_0.avalon_master_overlay/sdram_controller_0.s1 baseAddress 0x0000
add_connection vga_composer_overlay_0.avalon_master_render sdram_controller_0.s1 avalon
set_connection_parameter_value vga_composer_overlay_0.avalon_master_render/sdram_controller_0.s1 baseAddress 0x0000
add_connection vid_read_buffer_0.avalon_master fs_mm_0.ssram_uas avalon
set_connection_parameter_value vid_read_buffer_0.avalon_master/fs_mm_0.ssram_uas baseAddress 0x08200000
add_connection vid_read_buffer_0.avalon_master ssram_mm_0.slave avalon
set_connection_parameter_value vid_read_buffer_0.avalon_master/ssram_mm_0.slave baseAddress 0x08200000
add_connection bit_unpacker_0.source overlay_decoder_0.st_in avalon_streaming
add_connection cam_mm_to_st.source vga_st_composer_overlay_0.sink_camera avalon_streaming
add_connection camera_st_0.st0 st_naive_multi_0.din avalon_streaming
add_connection camera_st_1.st0 st_naive_multi_1.din avalon_streaming
add_connection dc_fifo_0.out st_naive_mux_0.din1 avalon_streaming
add_connection overlay_decoder_0.st_out vga_st_composer_overlay_0.sink_overlay avalon_streaming
add_connection render_mm_to_st.source vga_st_composer_overlay_0.sink_render avalon_streaming
add_connection st_naive_multi_0.dout0 camera_st_to_hsv_mm_0.sink avalon_streaming
add_connection st_naive_multi_0.dout1 st_naive_mux_0.din0 avalon_streaming
add_connection st_naive_multi_1.dout0 camera_st_to_hsv_mm_1.sink avalon_streaming
add_connection st_naive_multi_1.dout1 dc_fifo_0.in avalon_streaming
add_connection st_naive_mux_0.dout camera_st_to_rgb_mm_0.sink avalon_streaming
add_connection vid_read_buffer_0.source bit_unpacker_0.sink avalon_streaming
add_connection cam_mm_to_st.buffer_switch rgb_st_buffer_switcher_0.read_buffer conduit
add_connection overlay_buffer_switcher.read_buffer overlay_read_addr_gen_0.buffer_switch conduit
add_connection recog_buffer_switcher_0.write_buffer camera_st_to_hsv_mm_0.buffer_switch conduit
add_connection recog_buffer_switcher_1.write_buffer camera_st_to_hsv_mm_1.buffer_switch conduit
add_connection render_buffer_switcher.read_buffer render_mm_to_st.buffer_switch conduit
add_connection render_buffer_switcher.read_buffer vga_composer_overlay_0.render_buffer conduit
add_connection rgb_st_buffer_switcher_0.read_buffer vga_composer_overlay_0.cam_buffer conduit
add_connection rgb_st_buffer_switcher_0.write_buffer camera_st_to_rgb_mm_0.buffer_switch conduit
add_connection vga_composer_overlay_0.overlay_buffer overlay_buffer_switcher.read_buffer conduit
add_connection vid_read_buffer_0.addr_gen overlay_read_addr_gen_0.addr_gen conduit
add_connection nios2_gen2_0.irq jtag_uart_0.irq interrupt
set_connection_parameter_value nios2_gen2_0.irq/jtag_uart_0.irq irqNumber 0
add_connection nios2_gen2_1.irq jtag_uart_1.irq interrupt
set_connection_parameter_value nios2_gen2_1.irq/jtag_uart_1.irq irqNumber 0
add_connection nios2_gen2_2.irq jtag_uart_2.irq interrupt
set_connection_parameter_value nios2_gen2_2.irq/jtag_uart_2.irq irqNumber 0
add_connection nios2_gen2_3.irq jtag_uart_3.irq interrupt
set_connection_parameter_value nios2_gen2_3.irq/jtag_uart_3.irq irqNumber 0
add_connection nios2_gen2_4.irq jtag_uart_4.irq interrupt
set_connection_parameter_value nios2_gen2_4.irq/jtag_uart_4.irq irqNumber 0

# exported interfaces
add_interface cam_mm_to_st_vga_vsync conduit end
set_interface_property cam_mm_to_st_vga_vsync EXPORT_OF cam_mm_to_st.vga_vsync
add_interface camera_sioc_0_external_connection conduit end
set_interface_property camera_sioc_0_external_connection EXPORT_OF camera_sioc_0.external_connection
add_interface camera_sioc_1_external_connection conduit end
set_interface_property camera_sioc_1_external_connection EXPORT_OF camera_sioc_1.external_connection
add_interface camera_siod_0_external_connection conduit end
set_interface_property camera_siod_0_external_connection EXPORT_OF camera_siod_0.external_connection
add_interface camera_siod_1_external_connection conduit end
set_interface_property camera_siod_1_external_connection EXPORT_OF camera_siod_1.external_connection
add_interface camera_st_0_conduit conduit end
set_interface_property camera_st_0_conduit EXPORT_OF camera_st_0.conduit
add_interface camera_st_1_conduit conduit end
set_interface_property camera_st_1_conduit EXPORT_OF camera_st_1.conduit
add_interface clk clock sink
set_interface_property clk EXPORT_OF clk.clk_in
add_interface clk_vga clock sink
set_interface_property clk_vga EXPORT_OF clk_vga.clk_in
add_interface fs_wires conduit end
set_interface_property fs_wires EXPORT_OF fs_mm_0.fs_wires
add_interface ir_receiver_0_ir_clock clock sink
set_interface_property ir_receiver_0_ir_clock EXPORT_OF ir_receiver_0.ir_clock
add_interface ir_receiver_0_irda conduit end
set_interface_property ir_receiver_0_irda EXPORT_OF ir_receiver_0.IRDA
add_interface key_pio_external_connection conduit end
set_interface_property key_pio_external_connection EXPORT_OF key_pio.external_connection
add_interface new_sdram_controller_0_wire conduit end
set_interface_property new_sdram_controller_0_wire EXPORT_OF sdram_controller_0.wire
add_interface nios_terminal_output_enable conduit end
set_interface_property nios_terminal_output_enable EXPORT_OF niso_terminal_output_enable.external_connection
add_interface overlay_buffer_switcher_enable conduit end
set_interface_property overlay_buffer_switcher_enable EXPORT_OF overlay_buffer_switcher.enable
add_interface overlay_buffer_switcher_write_buffer conduit end
set_interface_property overlay_buffer_switcher_write_buffer EXPORT_OF overlay_buffer_switcher.write_buffer
add_interface overlay_port_pio_external_connection conduit end
set_interface_property overlay_port_pio_external_connection EXPORT_OF overlay_port_pio.external_connection
add_interface overlay_vsync_pio_external_connection conduit end
set_interface_property overlay_vsync_pio_external_connection EXPORT_OF overlay_vsync_pio.external_connection
add_interface recog_buffer_port_pio_0_external_connection conduit end
set_interface_property recog_buffer_port_pio_0_external_connection EXPORT_OF recog_buffer_port_pio_0.external_connection
add_interface recog_buffer_port_pio_1_external_connection conduit end
set_interface_property recog_buffer_port_pio_1_external_connection EXPORT_OF recog_buffer_port_pio_1.external_connection
add_interface recog_buffer_switcher_0_enable conduit end
set_interface_property recog_buffer_switcher_0_enable EXPORT_OF recog_buffer_switcher_0.enable
add_interface recog_buffer_switcher_0_read_buffer conduit end
set_interface_property recog_buffer_switcher_0_read_buffer EXPORT_OF recog_buffer_switcher_0.read_buffer
add_interface recog_buffer_switcher_1_enable conduit end
set_interface_property recog_buffer_switcher_1_enable EXPORT_OF recog_buffer_switcher_1.enable
add_interface recog_buffer_switcher_1_read_buffer conduit end
set_interface_property recog_buffer_switcher_1_read_buffer EXPORT_OF recog_buffer_switcher_1.read_buffer
add_interface recog_vsync_pio_0_external_connection conduit end
set_interface_property recog_vsync_pio_0_external_connection EXPORT_OF recog_vsync_pio_0.external_connection
add_interface recog_vsync_pio_1_external_connection conduit end
set_interface_property recog_vsync_pio_1_external_connection EXPORT_OF recog_vsync_pio_1.external_connection
add_interface render_buffer_switcher_enable conduit end
set_interface_property render_buffer_switcher_enable EXPORT_OF render_buffer_switcher.enable
add_interface render_buffer_switcher_write_buffer conduit end
set_interface_property render_buffer_switcher_write_buffer EXPORT_OF render_buffer_switcher.write_buffer
add_interface render_mm_to_st_vga_vsync conduit end
set_interface_property render_mm_to_st_vga_vsync EXPORT_OF render_mm_to_st.vga_vsync
add_interface render_port_pio_external_connection conduit end
set_interface_property render_port_pio_external_connection EXPORT_OF render_port_pio.external_connection
add_interface render_start_pio_external_connection conduit end
set_interface_property render_start_pio_external_connection EXPORT_OF render_start_pio.external_connection
add_interface render_vsync_pio_0_external_connection conduit end
set_interface_property render_vsync_pio_0_external_connection EXPORT_OF render_vsync_pio_0.external_connection
add_interface reset reset sink
set_interface_property reset EXPORT_OF clk.clk_in_reset
add_interface rgb_st_buffer_switcher_0_enable conduit end
set_interface_property rgb_st_buffer_switcher_0_enable EXPORT_OF rgb_st_buffer_switcher_0.enable
add_interface st_naive_mux_0_conduit conduit end
set_interface_property st_naive_mux_0_conduit EXPORT_OF st_naive_mux_0.conduit
add_interface sw_pio_0_external_connection conduit end
set_interface_property sw_pio_0_external_connection EXPORT_OF sw_pio_0.external_connection
add_interface vga_st_composer_overlay_0_conduit conduit end
set_interface_property vga_st_composer_overlay_0_conduit EXPORT_OF vga_st_composer_overlay_0.Conduit
add_interface vid_read_buffer_0_vsync conduit end
set_interface_property vid_read_buffer_0_vsync EXPORT_OF vid_read_buffer_0.vsync

set_interconnect_requirement {$system} qsys_mm.clockCrossingAdapter HANDSHAKE
set_interconnect_requirement {$system} qsys_mm.enableEccProtection FALSE
set_interconnect_requirement {$system} qsys_mm.insertDefaultSlave FALSE
set_interconnect_requirement {$system} qsys_mm.maxAdditionalLatency 3

save_system anxious_capture.qsys
